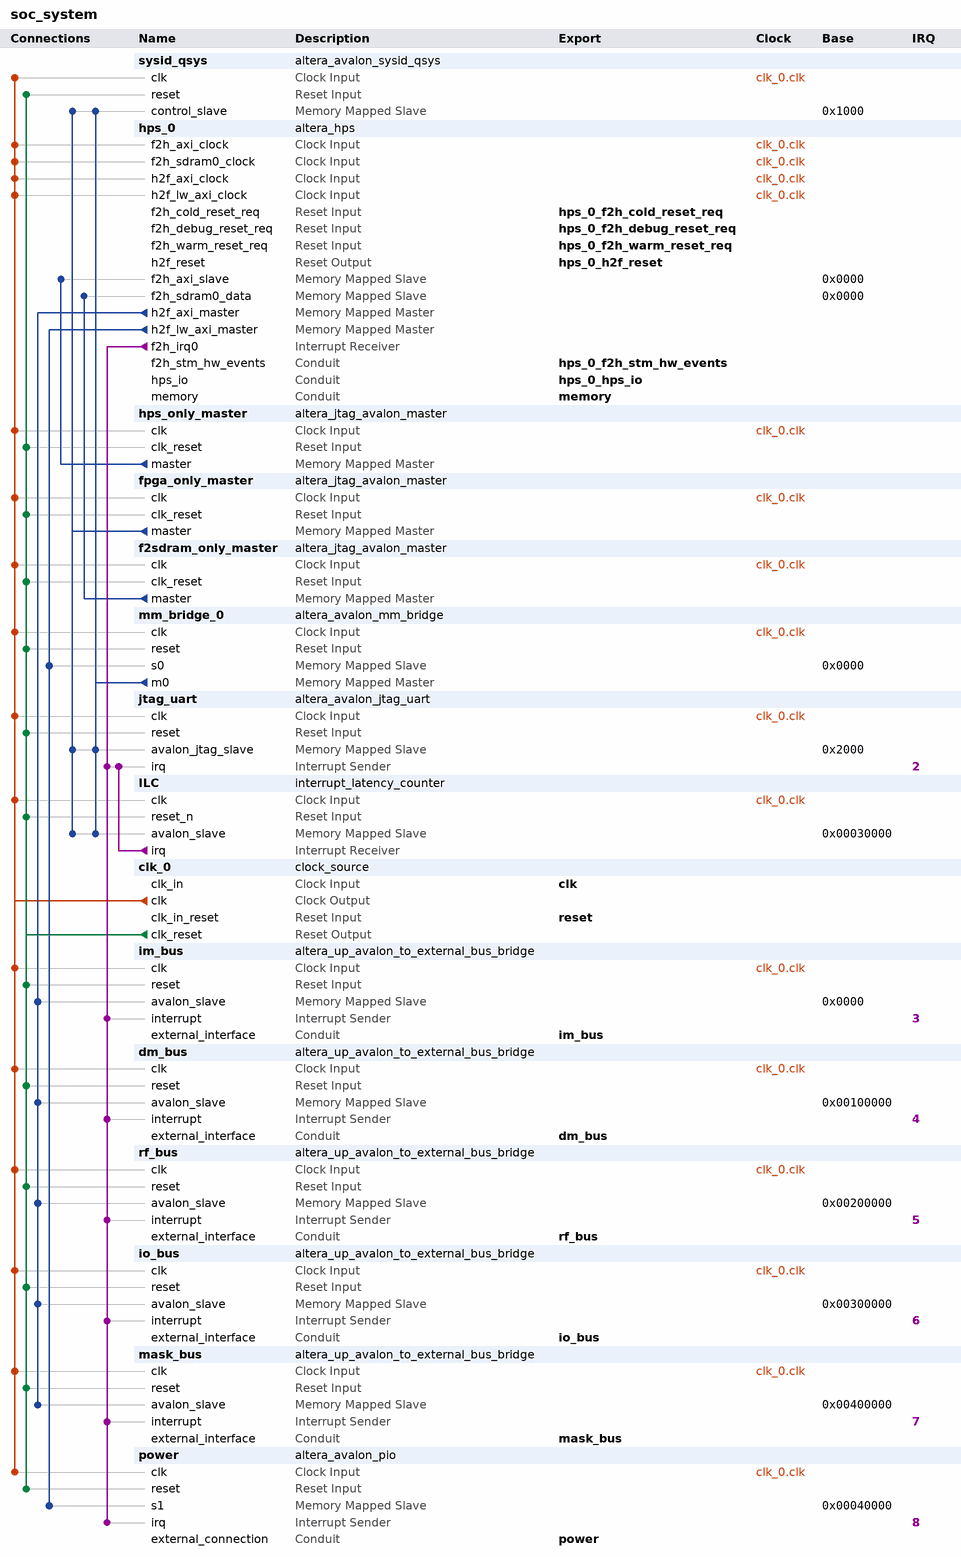
[diagram p0: system contents]
# Platform Designer (Qsys) system soc_system, Cyclone V 5CSEBA6U23I7
# Parameters at their usual value, and those the tool derives, are not listed.
package require -exact qsys 16.0
create_system soc_system
set_project_property DEVICE_FAMILY {Cyclone V}
set_project_property DEVICE 5CSEBA6U23I7

add_instance sysid_qsys altera_avalon_sysid_qsys 16.0
set_instance_parameter_value sysid_qsys id -1395322110

add_instance hps_0 altera_hps 16.0
set_instance_parameter_value hps_0 EMAC1_Mode RGMII
set_instance_parameter_value hps_0 EMAC1_PinMuxing {HPS I/O Set 0}
set_instance_parameter_value hps_0 F2SCLK_COLDRST_Enable true
set_instance_parameter_value hps_0 F2SCLK_DBGRST_Enable true
set_instance_parameter_value hps_0 F2SCLK_WARMRST_Enable true
set_instance_parameter_value hps_0 F2SDRAM_Type {Avalon-MM Bidirectional}
set_instance_parameter_value hps_0 F2SDRAM_Width 256
set_instance_parameter_value hps_0 F2SINTERRUPT_Enable true
set_instance_parameter_value hps_0 F2S_Width 2
set_instance_parameter_value hps_0 FPGA_PERIPHERAL_OUTPUT_CLOCK_FREQ_EMAC0_GTX_CLK 100
set_instance_parameter_value hps_0 FPGA_PERIPHERAL_OUTPUT_CLOCK_FREQ_EMAC0_MD_CLK 100.0
set_instance_parameter_value hps_0 FPGA_PERIPHERAL_OUTPUT_CLOCK_FREQ_EMAC1_GTX_CLK 100
set_instance_parameter_value hps_0 FPGA_PERIPHERAL_OUTPUT_CLOCK_FREQ_EMAC1_MD_CLK 100.0
set_instance_parameter_value hps_0 HPS_PROTOCOL DDR3
set_instance_parameter_value hps_0 I2C0_Mode I2C
set_instance_parameter_value hps_0 I2C0_PinMuxing {HPS I/O Set 0}
set_instance_parameter_value hps_0 I2C1_Mode I2C
set_instance_parameter_value hps_0 I2C1_PinMuxing {HPS I/O Set 0}
set_instance_parameter_value hps_0 LWH2F_Enable true
set_instance_parameter_value hps_0 MEM_BANKADDR_WIDTH 3
set_instance_parameter_value hps_0 MEM_CLK_FREQ 400.0
set_instance_parameter_value hps_0 MEM_COL_ADDR_WIDTH 10
set_instance_parameter_value hps_0 MEM_DQ_WIDTH 32
set_instance_parameter_value hps_0 MEM_DRV_STR RZQ/6
set_instance_parameter_value hps_0 MEM_ROW_ADDR_WIDTH 15
set_instance_parameter_value hps_0 MEM_RTT_NOM RZQ/6
set_instance_parameter_value hps_0 MEM_RTT_WR {Dynamic ODT off}
set_instance_parameter_value hps_0 MEM_TCL 7
set_instance_parameter_value hps_0 MEM_TFAW_NS 37.5
set_instance_parameter_value hps_0 MEM_TRAS_NS 35.0
set_instance_parameter_value hps_0 MEM_TRCD_NS 13.75
set_instance_parameter_value hps_0 MEM_TRFC_NS 300.0
set_instance_parameter_value hps_0 MEM_TRP_NS 13.75
set_instance_parameter_value hps_0 MEM_VENDOR Other
set_instance_parameter_value hps_0 MEM_WTCL 7
set_instance_parameter_value hps_0 QSPI_Mode N/A
set_instance_parameter_value hps_0 QSPI_PinMuxing Unused
set_instance_parameter_value hps_0 REF_CLK_FREQ 25.0
set_instance_parameter_value hps_0 S2FCLK_USER2CLK 4
set_instance_parameter_value hps_0 S2F_Width 3
set_instance_parameter_value hps_0 SDIO_Mode {4-bit Data}
set_instance_parameter_value hps_0 SDIO_PinMuxing {HPS I/O Set 0}
set_instance_parameter_value hps_0 SPIM1_Mode {Single Slave Select}
set_instance_parameter_value hps_0 SPIM1_PinMuxing {HPS I/O Set 0}
set_instance_parameter_value hps_0 STM_Enable true
set_instance_parameter_value hps_0 TIMING_BOARD_AC_SKEW 0.02
set_instance_parameter_value hps_0 TIMING_BOARD_AC_TO_CK_SKEW 0.0
set_instance_parameter_value hps_0 TIMING_BOARD_DQ_TO_DQS_SKEW 0.0
set_instance_parameter_value hps_0 TIMING_BOARD_MAX_CK_DELAY 0.6
set_instance_parameter_value hps_0 TIMING_BOARD_MAX_DQS_DELAY 0.6
set_instance_parameter_value hps_0 TIMING_BOARD_SKEW_BETWEEN_DQS 0.02
set_instance_parameter_value hps_0 TIMING_BOARD_SKEW_CKDQS_DIMM_MAX 0.01
set_instance_parameter_value hps_0 TIMING_BOARD_SKEW_CKDQS_DIMM_MIN -0.01
set_instance_parameter_value hps_0 TIMING_BOARD_SKEW_WITHIN_DQS 0.02
set_instance_parameter_value hps_0 TIMING_TDH 125
set_instance_parameter_value hps_0 TIMING_TDQSCK 400
set_instance_parameter_value hps_0 TIMING_TDQSQ 120
set_instance_parameter_value hps_0 TIMING_TDS 50
set_instance_parameter_value hps_0 TIMING_TIH 250
set_instance_parameter_value hps_0 TIMING_TIS 175
set_instance_parameter_value hps_0 TIMING_TQSH 0.38
set_instance_parameter_value hps_0 UART0_Mode {No Flow Control}
set_instance_parameter_value hps_0 UART0_PinMuxing {HPS I/O Set 0}
set_instance_parameter_value hps_0 USB1_Mode SDR
set_instance_parameter_value hps_0 USB1_PinMuxing {HPS I/O Set 0}
set_instance_parameter_value hps_0 desired_cfg_clk_mhz 100.0
set_instance_parameter_value hps_0 desired_qspi_clk_mhz 370.0

add_instance hps_only_master altera_jtag_avalon_master 16.0

add_instance fpga_only_master altera_jtag_avalon_master 16.0

add_instance f2sdram_only_master altera_jtag_avalon_master 16.0

add_instance mm_bridge_0 altera_avalon_mm_bridge 16.0
set_instance_parameter_value mm_bridge_0 ADDRESS_UNITS SYMBOLS
set_instance_parameter_value mm_bridge_0 ADDRESS_WIDTH 10
set_instance_parameter_value mm_bridge_0 DATA_WIDTH 32
set_instance_parameter_value mm_bridge_0 MAX_PENDING_RESPONSES 4
set_instance_parameter_value mm_bridge_0 USE_AUTO_ADDRESS_WIDTH 1

add_instance jtag_uart altera_avalon_jtag_uart 16.0
set_instance_parameter_value jtag_uart allowMultipleConnections true
set_instance_parameter_value jtag_uart simInteractiveOptions INTERACTIVE_ASCII_OUTPUT

add_instance ILC interrupt_latency_counter 16.0

add_instance clk_0 clock_source 16.0
set_instance_parameter_value clk_0 clockFrequency 50000000

add_instance im_bus altera_up_avalon_to_external_bus_bridge 15.1
set_instance_parameter_value im_bus addr_size 256
set_instance_parameter_value im_bus addr_size_multiplier Kbytes
set_instance_parameter_value im_bus data_size 32

add_instance dm_bus altera_up_avalon_to_external_bus_bridge 15.1
set_instance_parameter_value dm_bus addr_size 256
set_instance_parameter_value dm_bus addr_size_multiplier Kbytes
set_instance_parameter_value dm_bus data_size 32

add_instance rf_bus altera_up_avalon_to_external_bus_bridge 15.1
set_instance_parameter_value rf_bus addr_size 256
set_instance_parameter_value rf_bus addr_size_multiplier Kbytes
set_instance_parameter_value rf_bus data_size 32

add_instance io_bus altera_up_avalon_to_external_bus_bridge 15.1
set_instance_parameter_value io_bus addr_size 256
set_instance_parameter_value io_bus addr_size_multiplier Kbytes
set_instance_parameter_value io_bus data_size 32

add_instance mask_bus altera_up_avalon_to_external_bus_bridge 15.1
set_instance_parameter_value mask_bus addr_size 4
set_instance_parameter_value mask_bus addr_size_multiplier Kbytes
set_instance_parameter_value mask_bus data_size 128

add_instance power altera_avalon_pio 16.0
set_instance_parameter_value power direction InOut
set_instance_parameter_value power generateIRQ true
set_instance_parameter_value power width 1

# connections
add_connection clk_0.clk dm_bus.clk clock
add_connection clk_0.clk f2sdram_only_master.clk clock
add_connection clk_0.clk fpga_only_master.clk clock
add_connection clk_0.clk hps_0.f2h_axi_clock clock
add_connection clk_0.clk hps_0.f2h_sdram0_clock clock
add_connection clk_0.clk hps_0.h2f_axi_clock clock
add_connection clk_0.clk hps_0.h2f_lw_axi_clock clock
add_connection clk_0.clk hps_only_master.clk clock
add_connection clk_0.clk ILC.clk clock
add_connection clk_0.clk im_bus.clk clock
add_connection clk_0.clk io_bus.clk clock
add_connection clk_0.clk jtag_uart.clk clock
add_connection clk_0.clk mask_bus.clk clock
add_connection clk_0.clk mm_bridge_0.clk clock
add_connection clk_0.clk power.clk clock
add_connection clk_0.clk rf_bus.clk clock
add_connection clk_0.clk sysid_qsys.clk clock
add_connection clk_0.clk_reset dm_bus.reset reset
add_connection clk_0.clk_reset f2sdram_only_master.clk_reset reset
add_connection clk_0.clk_reset fpga_only_master.clk_reset reset
add_connection clk_0.clk_reset hps_only_master.clk_reset reset
add_connection clk_0.clk_reset ILC.reset_n reset
add_connection clk_0.clk_reset im_bus.reset reset
add_connection clk_0.clk_reset io_bus.reset reset
add_connection clk_0.clk_reset jtag_uart.reset reset
add_connection clk_0.clk_reset mask_bus.reset reset
add_connection clk_0.clk_reset mm_bridge_0.reset reset
add_connection clk_0.clk_reset power.reset reset
add_connection clk_0.clk_reset rf_bus.reset reset
add_connection clk_0.clk_reset sysid_qsys.reset reset
add_connection f2sdram_only_master.master hps_0.f2h_sdram0_data avalon
set_connection_parameter_value f2sdram_only_master.master/hps_0.f2h_sdram0_data baseAddress 0x0000
add_connection fpga_only_master.master ILC.avalon_slave avalon
set_connection_parameter_value fpga_only_master.master/ILC.avalon_slave baseAddress 0x00030000
add_connection fpga_only_master.master jtag_uart.avalon_jtag_slave avalon
set_connection_parameter_value fpga_only_master.master/jtag_uart.avalon_jtag_slave baseAddress 0x2000
add_connection fpga_only_master.master sysid_qsys.control_slave avalon
set_connection_parameter_value fpga_only_master.master/sysid_qsys.control_slave baseAddress 0x1000
add_connection hps_0.h2f_axi_master dm_bus.avalon_slave avalon
set_connection_parameter_value hps_0.h2f_axi_master/dm_bus.avalon_slave baseAddress 0x00100000
add_connection hps_0.h2f_axi_master im_bus.avalon_slave avalon
set_connection_parameter_value hps_0.h2f_axi_master/im_bus.avalon_slave baseAddress 0x0000
add_connection hps_0.h2f_axi_master io_bus.avalon_slave avalon
set_connection_parameter_value hps_0.h2f_axi_master/io_bus.avalon_slave baseAddress 0x00300000
add_connection hps_0.h2f_axi_master mask_bus.avalon_slave avalon
set_connection_parameter_value hps_0.h2f_axi_master/mask_bus.avalon_slave baseAddress 0x00400000
add_connection hps_0.h2f_axi_master rf_bus.avalon_slave avalon
set_connection_parameter_value hps_0.h2f_axi_master/rf_bus.avalon_slave baseAddress 0x00200000
add_connection hps_0.h2f_lw_axi_master mm_bridge_0.s0 avalon
set_connection_parameter_value hps_0.h2f_lw_axi_master/mm_bridge_0.s0 baseAddress 0x0000
add_connection hps_0.h2f_lw_axi_master power.s1 avalon
set_connection_parameter_value hps_0.h2f_lw_axi_master/power.s1 baseAddress 0x00040000
add_connection hps_only_master.master hps_0.f2h_axi_slave avalon
set_connection_parameter_value hps_only_master.master/hps_0.f2h_axi_slave baseAddress 0x0000
add_connection mm_bridge_0.m0 ILC.avalon_slave avalon
set_connection_parameter_value mm_bridge_0.m0/ILC.avalon_slave baseAddress 0x00030000
add_connection mm_bridge_0.m0 jtag_uart.avalon_jtag_slave avalon
set_connection_parameter_value mm_bridge_0.m0/jtag_uart.avalon_jtag_slave baseAddress 0x2000
add_connection mm_bridge_0.m0 sysid_qsys.control_slave avalon
set_connection_parameter_value mm_bridge_0.m0/sysid_qsys.control_slave baseAddress 0x1000
add_connection hps_0.f2h_irq0 dm_bus.interrupt interrupt
set_connection_parameter_value hps_0.f2h_irq0/dm_bus.interrupt irqNumber 4
add_connection hps_0.f2h_irq0 im_bus.interrupt interrupt
set_connection_parameter_value hps_0.f2h_irq0/im_bus.interrupt irqNumber 3
add_connection hps_0.f2h_irq0 io_bus.interrupt interrupt
set_connection_parameter_value hps_0.f2h_irq0/io_bus.interrupt irqNumber 6
add_connection hps_0.f2h_irq0 jtag_uart.irq interrupt
set_connection_parameter_value hps_0.f2h_irq0/jtag_uart.irq irqNumber 2
add_connection hps_0.f2h_irq0 mask_bus.interrupt interrupt
set_connection_parameter_value hps_0.f2h_irq0/mask_bus.interrupt irqNumber 7
add_connection hps_0.f2h_irq0 power.irq interrupt
set_connection_parameter_value hps_0.f2h_irq0/power.irq irqNumber 8
add_connection hps_0.f2h_irq0 rf_bus.interrupt interrupt
set_connection_parameter_value hps_0.f2h_irq0/rf_bus.interrupt irqNumber 5
add_connection ILC.irq jtag_uart.irq interrupt
set_connection_parameter_value ILC.irq/jtag_uart.irq irqNumber 2

# exported interfaces
add_interface clk clock sink
set_interface_property clk EXPORT_OF clk_0.clk_in
add_interface dm_bus conduit end
set_interface_property dm_bus EXPORT_OF dm_bus.external_interface
add_interface hps_0_f2h_cold_reset_req reset sink
set_interface_property hps_0_f2h_cold_reset_req EXPORT_OF hps_0.f2h_cold_reset_req
add_interface hps_0_f2h_debug_reset_req reset sink
set_interface_property hps_0_f2h_debug_reset_req EXPORT_OF hps_0.f2h_debug_reset_req
add_interface hps_0_f2h_stm_hw_events conduit end
set_interface_property hps_0_f2h_stm_hw_events EXPORT_OF hps_0.f2h_stm_hw_events
add_interface hps_0_f2h_warm_reset_req reset sink
set_interface_property hps_0_f2h_warm_reset_req EXPORT_OF hps_0.f2h_warm_reset_req
add_interface hps_0_h2f_reset reset source
set_interface_property hps_0_h2f_reset EXPORT_OF hps_0.h2f_reset
add_interface hps_0_hps_io conduit end
set_interface_property hps_0_hps_io EXPORT_OF hps_0.hps_io
add_interface im_bus conduit end
set_interface_property im_bus EXPORT_OF im_bus.external_interface
add_interface io_bus conduit end
set_interface_property io_bus EXPORT_OF io_bus.external_interface
add_interface mask_bus conduit end
set_interface_property mask_bus EXPORT_OF mask_bus.external_interface
add_interface memory conduit end
set_interface_property memory EXPORT_OF hps_0.memory
add_interface power conduit end
set_interface_property power EXPORT_OF power.external_connection
add_interface reset reset sink
set_interface_property reset EXPORT_OF clk_0.clk_in_reset
add_interface rf_bus conduit end
set_interface_property rf_bus EXPORT_OF rf_bus.external_interface

set_interconnect_requirement {$system} qsys_mm.clockCrossingAdapter HANDSHAKE
set_interconnect_requirement {$system} qsys_mm.maxAdditionalLatency 1

save_system soc_system.qsys
